# Altium schematic sheet Main.SchDoc
size A4; SheetNumber: 1; SheetTotal: 3
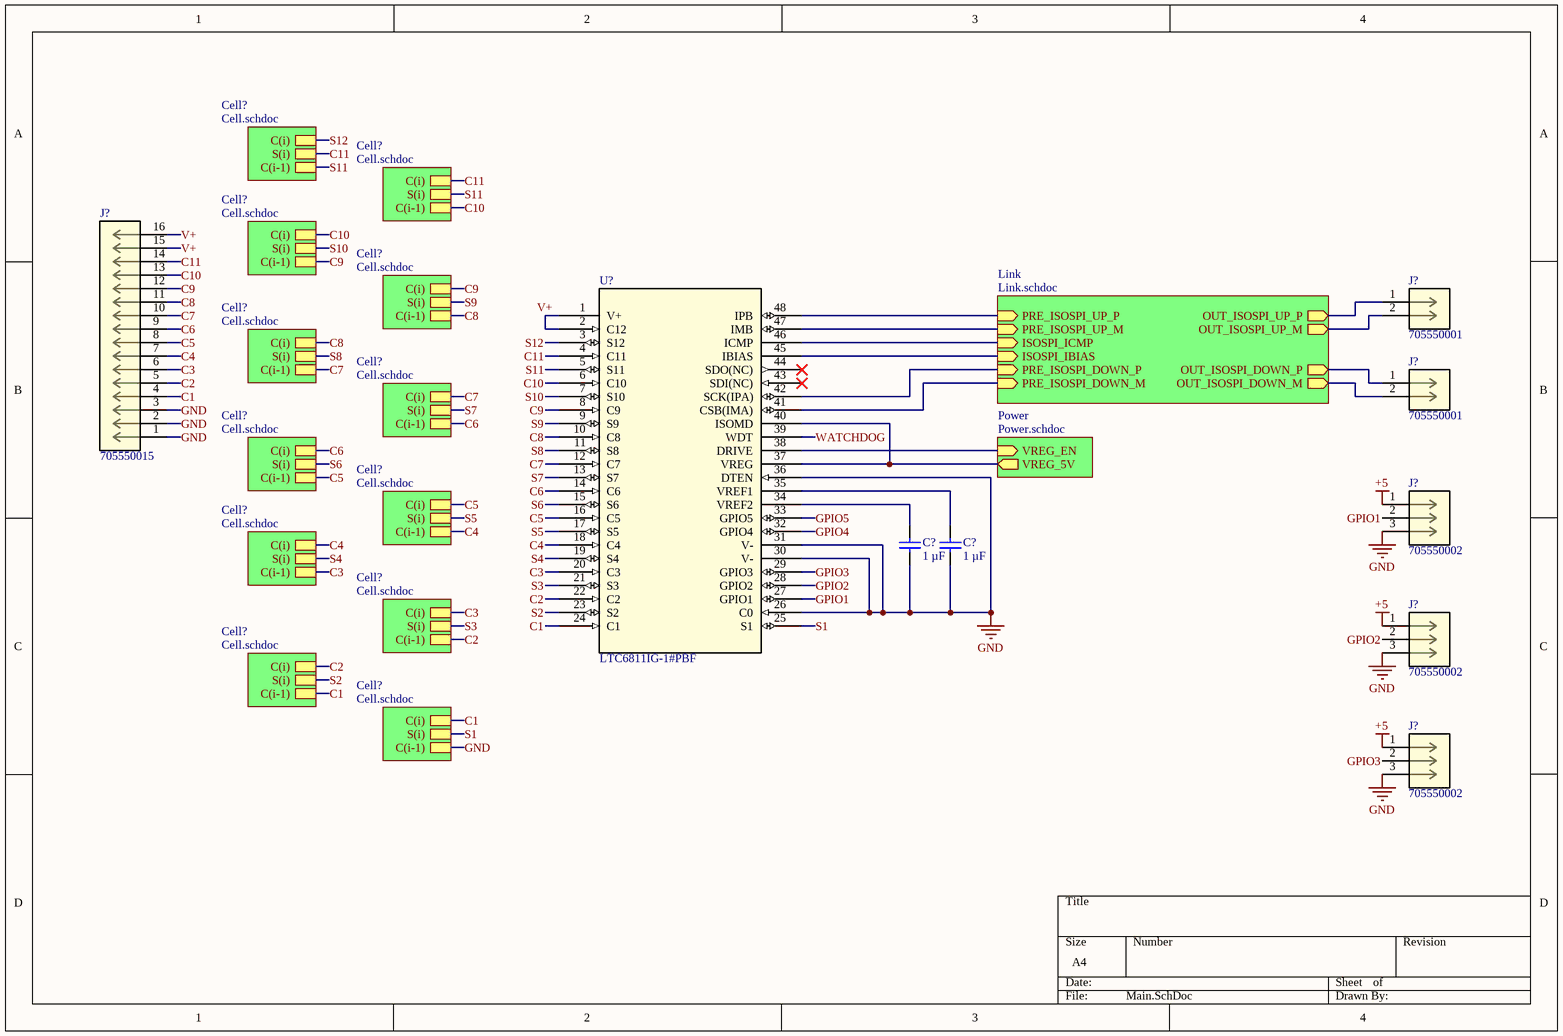
[diagram p0: Main.SchDoc]

## Parts
(Parts that share a designator on the sheet are numbered #1, #2 ... from top to bottom, then left to right.)
C?#1  value 1 µF  [0805_CAPACITOR]  (hidden comment: CL21B105KAFNNNE)
C?#2  value 1 µF  [0805_CAPACITOR]  (hidden comment: CL21B105KAFNNNE)
J?#1  705550001  [CONN_705550000-SD_02_MOL]
J?#2  705550001  [CONN_705550000-SD_02_MOL]
J?#3  705550015  [MOLEX-CON-16P-705550000]
J?#4  705550002  [CONN_705550000-SD_03_MOL]
J?#5  705550002  [CONN_705550000-SD_03_MOL]
J?#6  705550002  [CONN_705550000-SD_03_MOL]
U?  LTC6811IG-1#PBF  [48-SSOP]

## Sub-sheets
Cell? = Cell.schdoc: C(i), C(i-1), S(i)
Cell? = Cell.schdoc: C(i), C(i-1), S(i)
Cell? = Cell.schdoc: C(i), C(i-1), S(i)
Cell? = Cell.schdoc: C(i), C(i-1), S(i)
Cell? = Cell.schdoc: C(i), C(i-1), S(i)
Cell? = Cell.schdoc: C(i), C(i-1), S(i)
Cell? = Cell.schdoc: C(i), C(i-1), S(i)
Cell? = Cell.schdoc: C(i), C(i-1), S(i)
Cell? = Cell.schdoc: C(i), C(i-1), S(i)
Cell? = Cell.schdoc: C(i), C(i-1), S(i)
Cell? = Cell.schdoc: C(i), C(i-1), S(i)
Cell? = Cell.schdoc: C(i), C(i-1), S(i)
Link = Link.schdoc: PRE_ISOSPI_UP_P (in), PRE_ISOSPI_UP_M (in), ISOSPI_ICMP (in), ISOSPI_IBIAS (in), PRE_ISOSPI_DOWN_P (in), PRE_ISOSPI_DOWN_M (in), OUT_ISOSPI_UP_P (out), OUT_ISOSPI_UP_M (out), OUT_ISOSPI_DOWN_P (out), OUT_ISOSPI_DOWN_M (out)
Power = Power.schdoc: VREG_EN (in), VREG_5V (out)

## Nets
+5: J?#4.1 J?#5.1 J?#6.1
GND: C?#1.2 C?#2.2 J?#3.1 J?#3.2 J?#3.3 J?#4.3 J?#5.3 J?#6.3 U?.26(C0) U?.30(V-) U?.31(V-) U?.36(DTEN) ; sheet Cell?/C(i-1)
C1: J?#3.4 U?.24(C1) ; sheet Cell?/C(i), sheet Cell?/C(i-1)
C2: J?#3.5 U?.22(C2) ; sheet Cell?/C(i-1), sheet Cell?/C(i)
C3: J?#3.6 U?.20(C3) ; sheet Cell?/C(i), sheet Cell?/C(i-1)
C4: J?#3.7 U?.18(C4) ; sheet Cell?/C(i-1), sheet Cell?/C(i)
C5: J?#3.8 U?.16(C5) ; sheet Cell?/C(i), sheet Cell?/C(i-1)
C6: J?#3.9 U?.14(C6) ; sheet Cell?/C(i-1), sheet Cell?/C(i)
C7: J?#3.10 U?.12(C7) ; sheet Cell?/C(i), sheet Cell?/C(i-1)
C8: J?#3.11 U?.10(C8) ; sheet Cell?/C(i-1), sheet Cell?/C(i)
C9: J?#3.12 U?.8(C9) ; sheet Cell?/C(i), sheet Cell?/C(i-1)
C10: J?#3.13 U?.6(C10) ; sheet Cell?/C(i-1), sheet Cell?/C(i)
C11: J?#3.14 U?.4(C11) ; sheet Cell?/C(i), sheet Cell?/S(i)
GPIO1: J?#4.2 U?.27(GPIO1)
GPIO2: J?#5.2 U?.28(GPIO2)
GPIO3: J?#6.2 U?.29(GPIO3)
GPIO4: U?.32(GPIO4)
GPIO5: U?.33(GPIO5)
S1: U?.25(S1) ; sheet Cell?/S(i)
S2: U?.23(S2) ; sheet Cell?/S(i)
S3: U?.21(S3) ; sheet Cell?/S(i)
S4: U?.19(S4) ; sheet Cell?/S(i)
S5: U?.17(S5) ; sheet Cell?/S(i)
S6: U?.15(S6) ; sheet Cell?/S(i)
S7: U?.13(S7) ; sheet Cell?/S(i)
S8: U?.11(S8) ; sheet Cell?/S(i)
S9: U?.9(S9) ; sheet Cell?/S(i)
S10: U?.7(S10) ; sheet Cell?/S(i)
S11: U?.5(S11) ; sheet Cell?/S(i), sheet Cell?/C(i-1)
S12: U?.3(S12) ; sheet Cell?/C(i)
V+: J?#3.15 J?#3.16 U?.1(V+) U?.2(C12)
WATCHDOG: U?.39(WDT)
NetC?#1_1: C?#1.1 U?.34(VREF2)
NetC?#2_1: C?#2.1 U?.35(VREF1)
NetJ?#1_1: J?#1.1 ; sheet Link/OUT_ISOSPI_UP_P
NetJ?#1_2: J?#1.2 ; sheet Link/OUT_ISOSPI_UP_M
NetJ?#2_1: J?#2.1 ; sheet Link/OUT_ISOSPI_DOWN_P
NetJ?#2_2: J?#2.2 ; sheet Link/OUT_ISOSPI_DOWN_M
NetU?_37: U?.37(VREG) U?.40(ISOMD) ; sheet Power/VREG_5V
NetU?_38: U?.38(DRIVE) ; sheet Power/VREG_EN
NetU?_41: U?.41(CSB(IMA)) ; sheet Link/PRE_ISOSPI_DOWN_M
NetU?_42: U?.42(SCK(IPA)) ; sheet Link/PRE_ISOSPI_DOWN_P
NetU?_45: U?.45(IBIAS) ; sheet Link/ISOSPI_IBIAS
NetU?_46: U?.46(ICMP) ; sheet Link/ISOSPI_ICMP
NetU?_47: U?.47(IMB) ; sheet Link/PRE_ISOSPI_UP_M
NetU?_48: U?.48(IPB) ; sheet Link/PRE_ISOSPI_UP_P

Not connected (* = marked no-connect by the designer): U? 43(SDI(NC))* 44(SDO(NC))*

## Library data of the parts
C?#1 C?#2 = CL21B105KAFNNNE: 1 µF ±10% 25V Ceramic Capacitor X7R 0805 (2012 Metric)
J?#1 J?#2 = 705550001: 2.54mm Pitch SL Header, Single Row, Right Angle, 3.05mm Pocket, Shrouded, with Press-fit Plastic Peg, 2 Circuits, Tin (Sn) Plating; Manufacturer_Name: Molex Connector Corporation; Copyright: Copyright (C) 2025 Ultra Librarian. All rights reserved.; Manufacturer_Part_Number: 705550001; Datasheet: https://www.molex.com/en-us/products/part-detail-pdf/705550001?display=pdf; RefDes: RefDes; Type: Type
J?#3 = 705550015: 2.54mm Pitch SL Header, Single Row, Right Angle, 3.05mm Pocket, Shrouded, with Press-fit Plastic Peg, 16 Circuits, Tin (Sn) Plating; Manufacturer_Name: Molex Connector Corporation; Copyright: Copyright (C) 2025 Ultra Librarian. All rights reserved.; Manufacturer_Part_Number: 705550015; Datasheet: https://www.molex.com/en-us/products/part-detail-pdf/705550015?display=pdf; RefDes: RefDes; Type: Type
J?#4-J?#6 = 705550002: 2.54mm Pitch SL Header, Single Row, Right Angle, 3.05mm Pocket, Shrouded, with Press-fit Plastic Peg, 3 Circuits, Tin (Sn) Plating; Manufacturer_Name: Molex Connector Corporation; Copyright: Copyright (C) 2025 Ultra Librarian. All rights reserved.; Manufacturer_Part_Number: 705550002; Datasheet: https://www.molex.com/en-us/products/part-detail-pdf/705550002?display=pdf; RefDes: RefDes; Type: Type
U? = LTC6811IG-1PBF: 12 Channel Multicell Battery Monitor with Daisy Chain Interface, Generation 4; Manufacturer_Name: Analog Devices Inc; Type: Power Management; Copyright: Copyright (C) 2025 Ultra Librarian. All rights reserved.; Manufacturer_Part_Number: LTC6811IG-1#PBF; Datasheet: https://www.analog.com/media/en/technical-documentation/data-sheets/LTC6811-1-6811-2.pdf; RefDes: RefDes